# EAGLE design ECU (EAGLE 9.6.2)
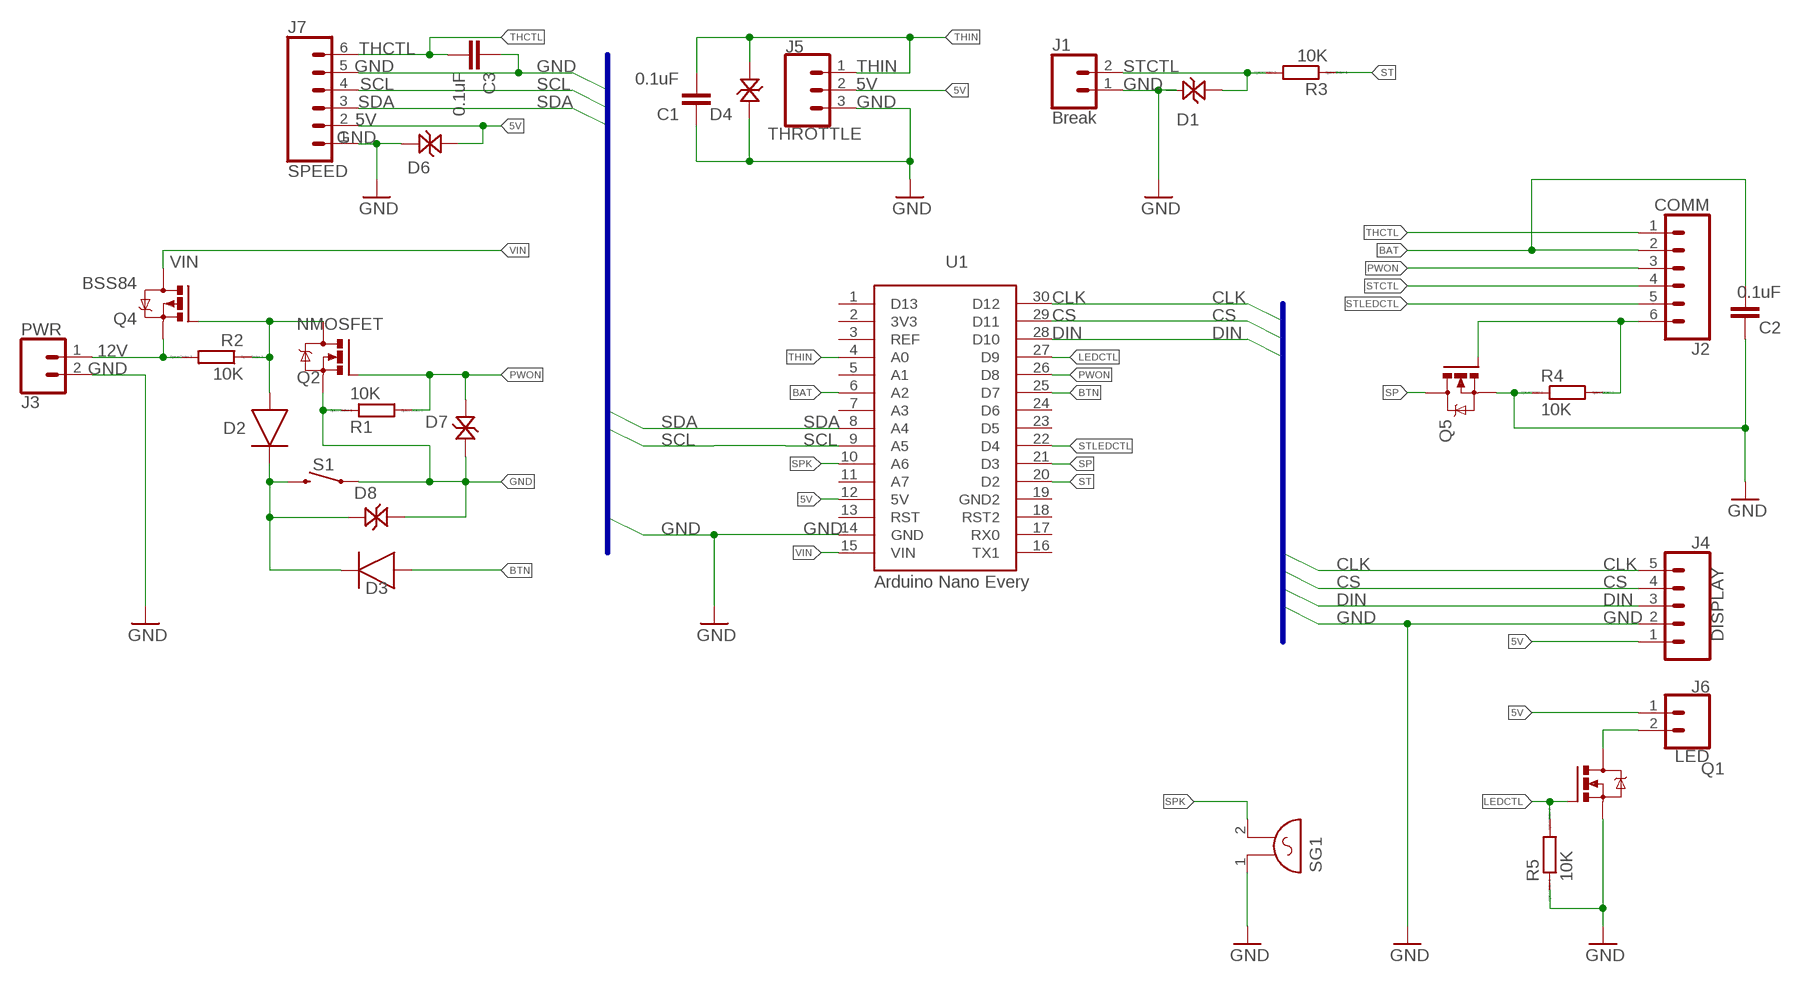
[diagram p0: schematic, sheet 1]

## Parts
C1  0.1uF  C_CHIP-1206(3216-METRIC)  [CAPC3216X135]
C2  0.1uF  C_CHIP-1206(3216-METRIC)  [CAPC3216X135]
C3  0.1uF  C_CHIP-1206(3216-METRIC)  [CAPC3216X135]
D1  TVS_DIODESMA  [DIOM5027X220N]
D2  DIODE_DO-215-AC  [SOD6126X290]
D3  DIODE_DO-215-AC  [SOD6126X290]
D4  TVS_DIODESMA  [DIOM5027X220N]
D6  TVS_DIODESMA  [DIOM5027X220N]
D7  TVS_DIODESMA  [DIOM5027X220N]
D8  TVS_DIODESMA  [DIOM5027X220N]
J1  Break  CONN_02  [1X02]
J2  COMM  CONN_06SILK_FEMALE_PTH  [1X06]
J3  PWR  CONN_02  [1X02]
J4  DISPLAY  CONN_05  [1X05]
J5  THROTTLE  CONN_03  [1X03]
J6  LED  CONN_02  [1X02]
J7  SPEED  CONN_06SILK_FEMALE_PTH  [1X06]
Q1  NMOSFET  NMOSFETSOT23  [SOT23]
Q2  NMOSFET  NMOSFETSOT23  [SOT23]
Q4  BSS84  PMOSFET_BSS84  [SOT23]
Q5  NMOSFET  NMOSFETSOT23  [SOT23]
R1  10K  RR1206  [R1206]
R2  10K  RR1206  [R1206]
R3  10K  RR1206  [R1206]
R4  10K  RR1206  [R1206]
R5  10K  RR1206  [R1206]
S1  MOMENTARY-SWITCH-SPST-PTH-6.0MM  [TACTILE_SWITCH_PTH_6.0MM]
SG1  F/HGP  [F/HGP]
U1  Arduino Nano Every  ARDUINOARDUINO_NANO  [SON254P1750X4300X120-30M]

## Nets
5V: D6.1 J4.1 J5.2 J6.1 J7.2 U1.12(5V)
12V: J3.1 Q4.2(S) R2.2
BAT: C2.1 J2.2 U1.6(A2)
BTN: D3.2(A) U1.25(D7)
CLK: J4.5 U1.30(D12)
CS: J4.4 U1.29(D11)
DIN: J4.3 U1.28(D10)
GND: C1.1 C2.2 C3.2 D1.1 D4.1 D6.2 D7.2 D8.1 J1.1 J3.2 J4.2 J5.3 J7.1 J7.5 Q1.2(S) Q2.2(S) Q5.2(S) R1.1 R4.1 R5.1 S1.1 S1.2 SG1.1 U1.14(GND)
LEDCTL: Q1.1(G) R5.2 U1.27(D9)
N$1: J6.2 Q1.3(D)
N$2: D2.2(A) Q2.3(D) Q4.1(G) R2.1
N$5: D2.1(C) D3.1(C) D8.2 S1.3 S1.4
PWON: D7.1 J2.3 Q2.1(G) R1.2 U1.26(D8)
SCL: J7.4 U1.9(A5)
SDA: J7.3 U1.8(A4)
SP: Q5.3(D) U1.21(D3)
SPEED: J2.6 Q5.1(G) R4.2
SPK: SG1.2 U1.10(A6)
ST: R3.1 U1.20(D2)
STCTL: D1.2 J1.2 J2.4 R3.2
STLEDCTL: J2.5 U1.22(D4)
THCTL: C3.1 J2.1 J7.6
THIN: C1.2 D4.2 J5.1 U1.4(A0)
VIN: Q4.3(D) U1.15(VIN)
Unconnected: U1.1(D13) U1.3(REF) U1.5(A1) U1.7(A3) U1.11(A7) U1.13(RST) U1.16(TX1) U1.17(RX0) U1.18(RST2) U1.23(D5) U1.24(D6)

## Buses
I2C:GND,SCL,SDA
SPI:CLK,CS,DIN,GND

## Power pins joined to a net without a drawn wire
3V3: U1.2(3V3)
GND2: U1.19(GND2)

## Library data of the parts
C1-C3 = Capacitor:C: Capacitor - Generic; CATEGORY: Capacitor
D1 D4 D6-D8 = eScooter:TVS_DIODE: TVS protective diode
D2 D3 = Diode:DIODE: Diode Rectifier - Generic; CATEGORY: Diode; SUB-CATEGORY: Rectifier
J1 J3 J6 = SparkFun-Connectors:CONN_02: Multi connection point. Often used as Generic Header-pin footprint for 0.1 inch spaced/style header connections On any of the 0.1 inch spaced packages, you can populate with these: Break Away Headers - Straight <https://www.sparkfun.com/products/116> (PRT-00116) Break Away Male Headers - Right Angle <https://www.sparkfun.com/products/553> (PRT-00553) Female Headers <https://www.sparkfun.com/products/115> (PRT-00115) Break Away Headers - Machine Pin <https://www.sparkfun.com/products/117> (PRT-00117) Break Away Female Headers - Swiss Machine Pin <https://www.sparkfun.com/products/743> (PRT-00743) For SCREWTERMINALS and SPRING TERMINALS visit here: Screw Terimnals on SparkFun.com <https://www.sparkfun.com/search/results?term=Screw+Terminals> (5mm/3.5mm/2.54mm spacing) This device is also useful as a general connection point to wire up your design to another part of your project. Our various solder wires solder well into these plated through hole pads. Hook-Up Wire - Assortment (Stranded, 22 AWG) <https://www.sparkfun.com/products/11375> (PRT-11375) Hook-Up Wire - Assortment (Solid Core, 22 AWG) <https://www.sparkfun.com/products/11367> (PRT-11367) View the entire wire category on our website here <https://www.sparkfun.com/categories/141> Special notes: Molex polarized connector foot print use with: PRT-08233 with associated crimp pins and housings. 2.54_SCREWTERM for use with PRT-10571. 3.5mm Screw Terminal footprints for PRT-08084 5mm Screw Terminal footprints for use with PRT-08432
J2 J7 = SparkFun-Connectors:CONN_06: Multi connection point. Often used as Generic Header-pin footprint for 0.1 inch spaced/style header connections On any of the 0.1 inch spaced packages, you can populate with these: Break Away Headers - Straight <https://www.sparkfun.com/products/116> (PRT-00116) Break Away Male Headers - Right Angle <https://www.sparkfun.com/products/553> (PRT-00553) Female Headers <https://www.sparkfun.com/products/115> (PRT-00115) Break Away Headers - Machine Pin <https://www.sparkfun.com/products/117> (PRT-00117) Break Away Female Headers - Swiss Machine Pin <https://www.sparkfun.com/products/743> (PRT-00743) Arduino Stackable Header - 6 Pin <https://www.sparkfun.com/products/9280> (PRT-09280) For SCREWTERMINALS and SPRING TERMINALS visit here: Screw Terimnals on SparkFun.com <https://www.sparkfun.com/search/results?term=Screw+Terminals> (5mm/3.5mm/2.54mm spacing) This device is also useful as a general connection point to wire up your design to another part of your project. Our various solder wires solder well into these plated through hole pads. Hook-Up Wire - Assortment (Stranded, 22 AWG) <https://www.sparkfun.com/products/11375> (PRT-11375) Hook-Up Wire - Assortment (Solid Core, 22 AWG) <https://www.sparkfun.com/products/11367> (PRT-11367) View the entire wire category on our website here <https://www.sparkfun.com/categories/141>; PROD_ID: CONN-08437
J4 = SparkFun-Connectors:CONN_05: Multi connection point. Often used as Generic Header-pin footprint for 0.1 inch spaced/style header connections On any of the 0.1 inch spaced packages, you can populate with these: Break Away Headers - Straight <https://www.sparkfun.com/products/116> (PRT-00116) Break Away Male Headers - Right Angle <https://www.sparkfun.com/products/553> (PRT-00553) Female Headers <https://www.sparkfun.com/products/115> (PRT-00115) Break Away Headers - Machine Pin <https://www.sparkfun.com/products/117> (PRT-00117) Break Away Female Headers - Swiss Machine Pin <https://www.sparkfun.com/products/743> (PRT-00743) For SCREWTERMINALS and SPRING TERMINALS visit here: Screw Terimnals on SparkFun.com <https://www.sparkfun.com/search/results?term=Screw+Terminals> (5mm/3.5mm/2.54mm spacing) This device is also useful as a general connection point to wire up your design to another part of your project. Our various solder wires solder well into these plated through hole pads. Hook-Up Wire - Assortment (Stranded, 22 AWG) <https://www.sparkfun.com/products/11375> (PRT-11375) Hook-Up Wire - Assortment (Solid Core, 22 AWG) <https://www.sparkfun.com/products/11367> (PRT-11367) View the entire wire category on our website here <https://www.sparkfun.com/categories/141> Special notes: Molex polarized connector foot print use with SKU : PRT-08231 with associated crimp pins and housings. 1MM SMD Version SKU: PRT-10208
J5 = SparkFun-Connectors:CONN_03: Multi connection point. Often used as Generic Header-pin footprint for 0.1 inch spaced/style header connections On any of the 0.1 inch spaced packages, you can populate with these: Break Away Headers - Straight <https://www.sparkfun.com/products/116> (PRT-00116) Break Away Male Headers - Right Angle <https://www.sparkfun.com/products/553> (PRT-00553) Female Headers <https://www.sparkfun.com/products/115> (PRT-00115) Break Away Headers - Machine Pin <https://www.sparkfun.com/products/117> (PRT-00117) Break Away Female Headers - Swiss Machine Pin <https://www.sparkfun.com/products/743> (PRT-00743) Stackable Header - 3 Pin (Female, 0.1") <https://www.sparkfun.com/products/13875> (PRT-13875) For SCREWTERMINALS and SPRING TERMINALS visit here: Screw Terimnals on SparkFun.com <https://www.sparkfun.com/search/results?term=Screw+Terminals> (5mm/3.5mm/2.54mm spacing) This device is also useful as a general connection point to wire up your design to another part of your project. Our various solder wires solder well into these plated through hole pads. Hook-Up Wire - Assortment (Stranded, 22 AWG) <https://www.sparkfun.com/products/11375> (PRT-11375) Hook-Up Wire - Assortment (Solid Core, 22 AWG) <https://www.sparkfun.com/products/11367> (PRT-11367) View the entire wire category on our website here <https://www.sparkfun.com/categories/141> Special notes: Molex polarized connector foot print use with SKU : PRT-08232 with associated crimp pins and housings.
Q1 Q2 Q5 = Transistor:NMOSFET: N-Channel MOSFET - Generic; CATEGORY: Transistor; SUB-CATEGORY: MOSFET; TYPE: N-Channel
Q4 = Transistor:PMOSFET_: P-Channel MOSFET - Popular parts; CATEGORY: Transistor; DESCRIPTION: MOSFET P-CH 50V 130MA SOT-23; DRAIN_CURRENT: 130mA; MANUFACTURER: ON Semiconductor; MPN: BSS84; OPERATING_TEMP: -55°C ~ 150°C; PART_STATUS: Active; ROHS_COMPLIANT: Yes; SUB-CATEGORY: MOSFET; THERMALLOSS: 360mW; TYPE: P-Channel
R1-R5 = eagle-ltspice:R: RESISTOR, European symbol; SPICEMODEL: NONE; SPICEPREFIX: R
S1 = SparkFun-Switches:MOMENTARY-SWITCH-SPST: Momentary Switch (Pushbutton) - SPST Normally-open (NO) SPST momentary switches (buttons, pushbuttons). Variants PTH-12MM - 12mm square, through-hole Momentary Pushbutton Switch - 12mm Square <https://www.sparkfun.com/products/9190> (COM-09190) PTH-6.0MM, PTH-6.0MM-KIT - 6.0mm square, through-hole Mini Pushbutton Switch <https://www.sparkfun.com/products/97> (COM-00097) KIT package intended for soldering kit's - only one side of pads' copper is exposed. PTH-RIGHT-ANGLE-KIT - Right-angle, through-hole Right Angle Tactile Button <https://www.sparkfun.com/products/10791> - Used on SparkFun BigTime Watch Kit <https://www.sparkfun.com/products/11734> SMD-12MM - 12mm square, surface-mount Tactile Button - SMD (12mm) <https://www.sparkfun.com/products/12993> (COM-12993) Used on SparkFun PicoBoard <https://www.sparkfun.com/products/11888> SMD-4.5MM - 4.5mm Square Trackball Switch Used on SparkFun Blackberry Trackballer Breakout <https://www.sparkfun.com/products/13169> SMD-4.6MMX2.8MM - 4.60mm x 2.80mm, surface mount Used on SparkFun SAMD21 Mini Breakout <https://www.sparkfun.com/products/13664> SMD-5.2MM, SMD-5.2-REDUNDANT - 5.2mm square, surface-mount Mini Pushbutton Switch - SMD <https://www.sparkfun.com/products/8720> (COM-08720) Used on Arduino Pro Mini <https://www.sparkfun.com/products/11114> REDUNDANT package connects both switch circuits together SMD-6.0X3.5MM - 6.0 x 3.5mm, surface mount Momentary Reset Switch SMD <https://www.sparkfun.com/products/8229> (COM-08229) SMD-6.2MM-TALL - 6.2mm square, surface mount Tactile Button - SMD (6mm) <https://www.sparkfun.com/products/12992> Used on SparkFun Digital Sandbox <https://www.sparkfun.com/products/12651> SMD-RIGHT-ANGLE - Right-angle, surface mount Used on SparkFun Block for Intel® Edison - Arduino <https://www.sparkfun.com/products/13036>; PROD_ID: SWCH-08441; SF_SKU: COM-00097
SG1 = buzzer:F/HGP: BUZZER Source: Buerklin; OC_FARNELL: unknown; OC_NEWARK: unknown
U1 = eScooter:ARDUINO: Ardino nano

## Board
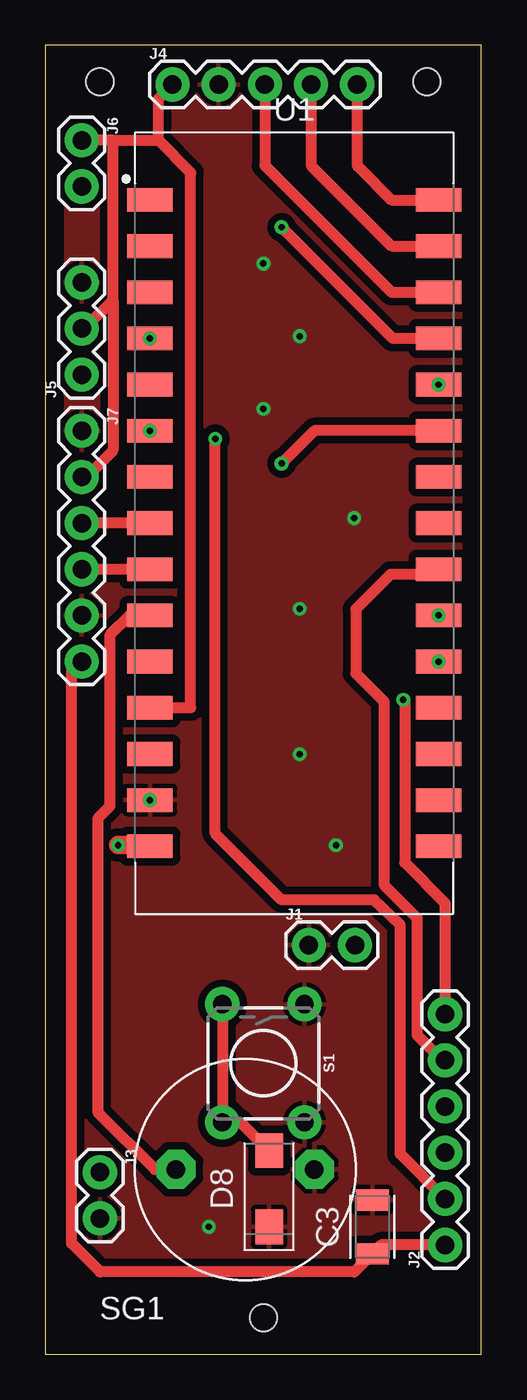
[diagram p1: board, top side]
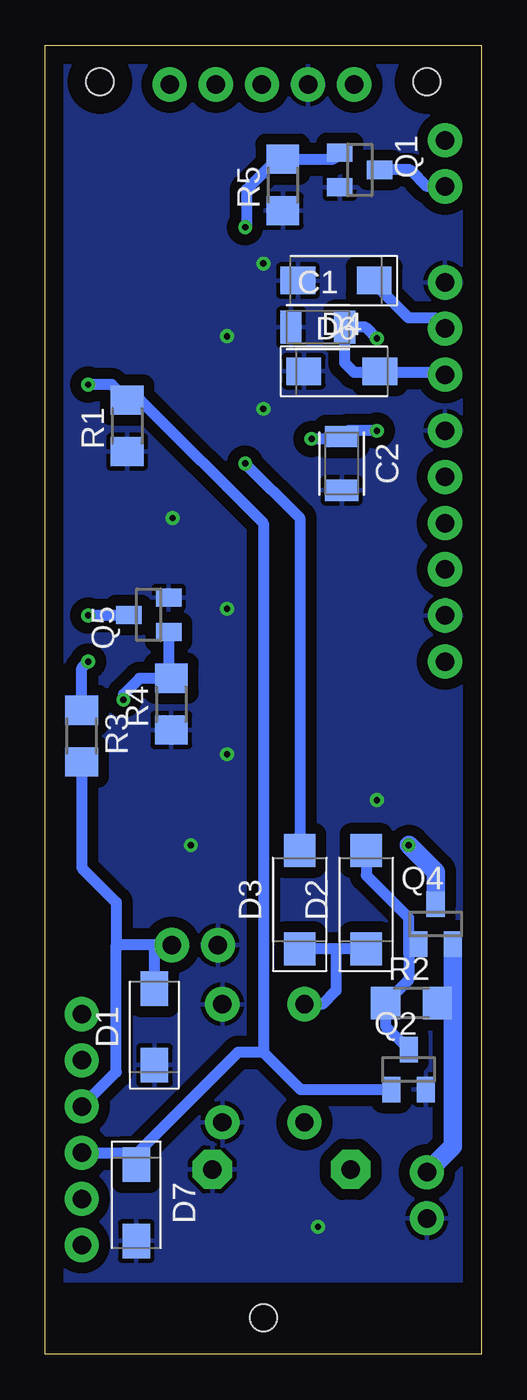
[diagram p2: board, bottom side, seen from below]

Size 24 x 72 mm. Coordinates in mm from the lower left corner, seen from the top.
Outline: 0,0 24,0 24,72 0,72 0,0
Copper layers (1*16): Top 0.035mm / dielectric 1.5mm / Bottom 0.035mm
Design rules "default *": minimum track width 6mil, minimum drill 0.35mm, track to track 12mil, track to pad 12mil, pad to pad 12mil, via to via 12mil, smd to smd 6mil, copper to edge 40mil, drill to drill 6mil, minimum pad ring 10mil, minimum via ring 8mil, stop-mask expansion 4mil, vias tented up to drill 0mil, thermal gap 10mil
Holes 1.5 mm at 21,70 3,70 12,2

### Footprints (pad centres in the part's own frame; a part is rotated, then mirrored left to right if it is on the bottom)
CAPC3216X135 = smd 1.165 x 1.815: 1 -1.475,0; 2 1.475,0
DIOM5027X220N = smd 1.912 x 1.512: 1 -2.1,0; 2 2.1,0
SOD6126X290 = smd 1.798 x 1.725: 1 -2.705,0; 2 2.705,0
1X02 = drill 1.016 pad 1.88: 1 0,0; 2 2.54,0
1X06 = drill 1.016 pad 1.88: 1 0,0; 2 2.54,0; 3 5.08,0; 4 7.62,0; 5 10.16,0; 6 12.7,0
1X05 = drill 1.016 pad 1.88: 1 0,0; 2 2.54,0; 3 5.08,0; 4 7.62,0; 5 10.16,0
1X03 = drill 1.016 pad 1.88: 1 0,0; 2 2.54,0; 3 5.08,0
SOT23 = smd 1 x 1.4: 1 -0.95,-1.1; 2 0.95,-1.1; 3 0,1.1
R1206 = smd 1.6 x 1.803: 1 -1.422,0; 2 1.422,0
TACTILE_SWITCH_PTH_6.0MM = drill 1.016 pad 1.88: 1 -3.251,2.261; 2 3.251,2.261; 3 -3.251,-2.261; 4 3.251,-2.261
F/HGP = drill 1.016 pad 2.159 octagon: 1 -3.81,0; 2 3.81,0
SON254P1750X4300X120-30M = smd 2.512 x 1.302: 1 -7.95,17.78; 2 -7.95,15.24; 3 -7.95,12.7; 4 -7.95,10.16; 5 -7.95,7.62; 6 -7.95,5.08; 7 -7.95,2.54; 8 -7.95,0; 9 -7.95,-2.54; 10 -7.95,-5.08; 11 -7.95,-7.62; 12 -7.95,-10.16; 13 -7.95,-12.7; 14 -7.95,-15.24; 15 -7.95,-17.78; 16 7.95,-17.78; 17 7.95,-15.24; 18 7.95,-12.7; 19 7.95,-10.16; 20 7.95,-7.62; 21 7.95,-5.08; 22 7.95,-2.54; 23 7.95,0; 24 7.95,2.54; 25 7.95,5.08; 26 7.95,7.62; 27 7.95,10.16; 28 7.95,12.7; 29 7.95,15.24; 30 7.95,17.78

### Placement (x,y rotation side)
C1  9,56.5 0 bottom
C2  7.69,49 270 bottom
C3  18,7 90 top
D1  18,18 90 bottom
D2  6.34,25 90 bottom
D3  10,25 90 bottom
D4  7.68,54.07 0 bottom
D6  8,59.07 180 bottom
D7  19,8.32 270 bottom
D8  12.31,9.1 90 top
J1  14.5,22.5 0 top
J2  22,6 90 top
J3  3,10 270 top
J4  7,69.85 0 top
J5  2,53.88 90 top
J6  2,66.78 270 top
J7  2,50.8 270 top
Q1  6.69,65.15 270 bottom
Q2  4,15.66 0 bottom
Q4  2.52,23.66 0 bottom
Q5  18.31,40.67 90 bottom
R1  19.5,51.07 90 bottom
R2  3.85,19.31 0 bottom
R3  22,34 270 bottom
R4  17.07,35.76 90 bottom
R5  10.93,64.32 90 bottom
S1  12,16 270 top
SG1  11,10.16 180 top
U1  13.7,45.72 0 top

### Tracks (layer width: path | path; a pad name or v marks a point on that pad's centre or on a via)
5V
  Top 0.61: U1.12 8,35.56 8,65 6.22,66.78 | 3.72,66.78 6.22,66.78 | 6.22,66.78 6.22,69.07 J4.1 | 3.72,66.78 J6.1 | 3.72,58 3.72,66.78 | 3.72,58 2.14,56.42 J5.2 | J7.2 2.26,48.26 3.72,49.72 3.72,58
  Bottom 0.61: D6.1 5.9,58.9 4,57 2.58,57 J5.2
12V
  Bottom 1.016: Q4.2 1.57,19 | 1.57,19 1.88,19.31 R2.2 | J3.1 1.57,11.43 1.57,19
BAT  (via drill 0.35)
  Top 0.61: J2.2 19.54,11 19.54,23.62 18.09,25 13,25 9.35,28.65 v9.35,50.35
  Bottom 0.61: U1.6 7.37,50.8 C2.1 7.82,50.35 v9.35,50.35
  other vias: 5.75,50.8
BTN  (via drill 0.35)
  Top 0.61: U1.25 14.8,50.8 v13,49
  Bottom 0.61: D3.2 10,46 v13,49
CLK
  Top 0.61: U1.30 19.05,63.5 17.27,65.28 17.16,65.39 J4.5
CS
  Top 0.61: U1.29 19.05,60.96 14.62,65.39 J4.4
DIN
  Top 0.61: U1.28 19.05,58.42 12.08,65.39 J4.3
GND  (via drill 0.35)
  other vias: 5.75,30.48 9,7 14,41 17,46 12,52 14,56 12,60 14,33 16,28
  pour Top (isolate 0.406): 0,72 0,4 24,4 24,72
  pour Bottom (isolate 0.61): 0,72 0,4 24,4 24,72
LEDCTL  (via drill 0.35)
  Top 0.61: U1.27 19.12,55.88 v13,62
  Bottom 0.61: v13,62 12.93,62.07 12.93,64.07 11.26,65.74 R5.2 8.15,65.74 Q1.1
N$1
  Bottom 0.61: J6.2 3,64.24 3.91,65.15 Q1.3
N$2
  Bottom 0.61: 4,22.03 4,20.58 R2.1 5.27,18.03 Q2.3 | Q4.1 4,22.03 | 4,22.03 4,24 6.34,26.34 D2.2 | D2.2 6.04,28 6,28 6.29,27.7 D2.2
N$5
  Top 0.61: D8.2 12.29,11.2 10.74,12.75 S1.4 S1.3
  Bottom 0.61: D2.1 8,22.3 | 8,22.3 D3.1 | 8,22.3 8,20 8.75,19.25 S1.3
PWON  (via drill 0.35)
  Bottom 0.61: U1.26 20.35,53.34 R1.2 18.78,52.49 12,45.71 12,16.61 | J2.3 21.96,11.04 | 21.96,11.04 21.92,11 | D7.1 19.29,10.71 | 19.29,10.71 19.62,11.04 21.96,11.04 | 12,16.61 9.95,14.56 Q2.1 | 19.29,10.71 13.5,16.5 13.39,16.61 12,16.61
  other vias: 21.65,53.34
SCL
  Top 0.61: J7.4 U1.9
SDA
  Top 0.61: U1.8 J7.3
SP  (via drill 0.35)
  Bottom 0.61: 19.44,40.64 20,40.64 | 20,40.64 U1.21 | Q5.3 19.97,40.67 20,40.64
  other vias: 21.65,40.64
SPEED  (via drill 0.35)
  Top 0.61: J2.6 22,24.82 19.79,27.04 19.79,36 v19.7,36
  Bottom 0.61: Q5.1 17.21,37.32 R4.2 18.82,37.18 19.7,36.3 v19.7,36 19.78,36
SPK
  Top 0.61: U1.10 4.64,40.64 3.55,39.55 3.55,30.13 2.88,29.46 2.88,13.31 6.03,10.16 SG1.2
ST  (via drill 0.35)
  Bottom 0.61: U1.20 22,37.75 R3.1
  other vias: 21.65,38.1
STCTL
  Bottom 0.61: J2.4 20.1,15.52 20.1,22.5 | 20.1,22.5 20.1,24.85 22,26.75 R3.2 | J1.2 18,22.5 | 18,22.5 20.1,22.5 | D1.2 18,22.5
STLEDCTL
  Top 0.61: U1.22 21.37,42.9 18.99,42.9 17.08,40.99 17.08,37.45 18.64,35.89 18.64,25.82 20.45,24 20.45,17.55 21.84,16.16 J2.5
THCTL
  Top 0.61: J2.1 18.48,6 C3.1 17,4.53 3,4.53 1.44,6.09 1.44,37.53 J7.6
THIN  (via drill 0.35)
  Top 0.61: U1.4 5.12,55.88 5,56
  Bottom 0.61: J5.1 2.12,54 5.51,54 | 5.51,54 7,54 7.53,54.52 C1.2 6.37,56.5 U1.4 | D4.2 5.51,54
  other vias: 5.75,55.88
VIN  (via drill 0.35)
  Top 0.61: U1.15 5.69,28
  Top 1.016: 5.69,28 v4,28
  Bottom 1.016: Q4.3 2.52,26.52 v4,28